# EAGLE design nakresy (EAGLE 7.2.0)
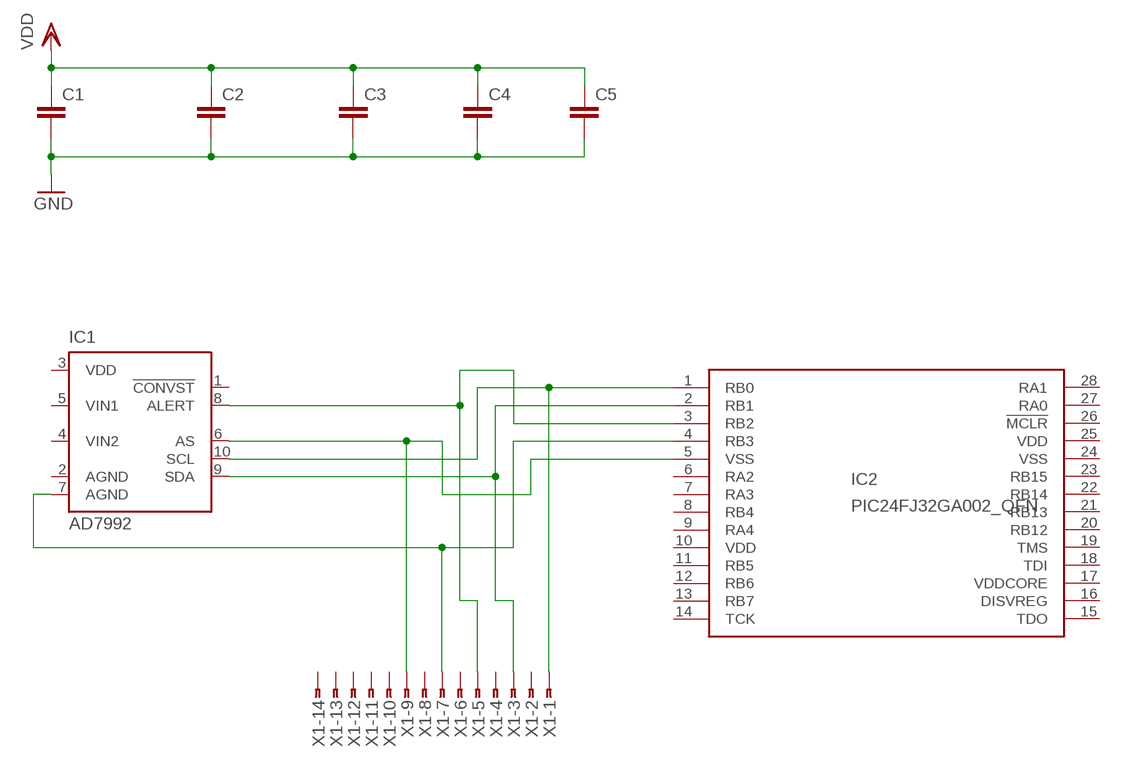
[diagram p0: schematic, sheet 1]

## Parts
C1  C-EUC0805K  [C0805K]
C2  C-EUC0805K  [C0805K]
C3  C-EUC0805K  [C0805K]
C4  C-EUC0805K  [C0805K]
C5  C-EUC0805K  [C0805K]
IC1  AD7992  [MSOP10]
IC2  PIC24FJ32GA002_QFN  [QFN28-ML_6X6MM]
X1  SMDTOP-14  [SMDTOP14]

## Nets
GND: C1.2 C2.2 C3.2 C4.2 C5.2
N$2: IC1.10(SCL) IC2.1(RB0) X1.1
N$3: IC1.9(SDA) IC2.2(RB1) X1.3
N$4: IC1.8(ALERT) IC2.3(RB2) X1.5
N$5: IC1.7(AGND) IC2.4(RB3) X1.7
N$6: IC1.6(AS) IC2.5(VSS) X1.9
VDD: C1.1 C2.1 C3.1 C4.1 C5.1
Unconnected: IC1.1(!CONVST) IC1.4(VIN2) IC1.5(VIN1) IC2.6(RA2) IC2.7(RA3) IC2.8(RB4) IC2.9(RA4) IC2.11(RB5) IC2.12(RB6) IC2.13(RB7) IC2.14(TCK) IC2.15(TDO) IC2.16(DISVREG) IC2.18(TDI) IC2.19(TMS) IC2.20(RB12) IC2.21(RB13) IC2.22(RB14) IC2.23(RB15) IC2.26(!MCLR) IC2.27(RA0) IC2.28(RA1) X1.2 X1.4 X1.6 X1.8 X1.10 X1.11 X1.12 X1.13 X1.14

## Power pins joined to a net without a drawn wire
AGND: IC1.2(AGND)
VDD: IC1.3(VDD) IC2.10(VDD) IC2.25(VDD)
VDDCORE: IC2.17(VDDCORE)
VSS: IC2.24(VSS)

## Library data of the parts
C1-C5 = rcl:C-EU: CAPACITOR, European symbol
IC1 = analog-devices:AD7992: 2-Channel, 12-Bit ADC with I2C-Compatible Interface 10-Lead MSOP Source: http://www.analog.com/UploadedFiles/Data_Sheets/224965274AD7992_0.pdf; MPN: AD7992BRMZ-0; OC_FARNELL: 1078311; OC_NEWARK: 31M4422
IC2 = microchip:PIC24FJ32GA002_QFN: PIC24FJ32GA002_QFN edit this description Auto generated by make-symbol-device-package-bsdl.ulp Rev. 25 Source: PIC24FJ32GA002_QFN.bsd; MPN: PIC24FJ32GA002-I/ML; OC_FARNELL: unknown; OC_NEWARK: 88K6121
X1 = con-amp:SMDTOP-14: AMP connector

## Board
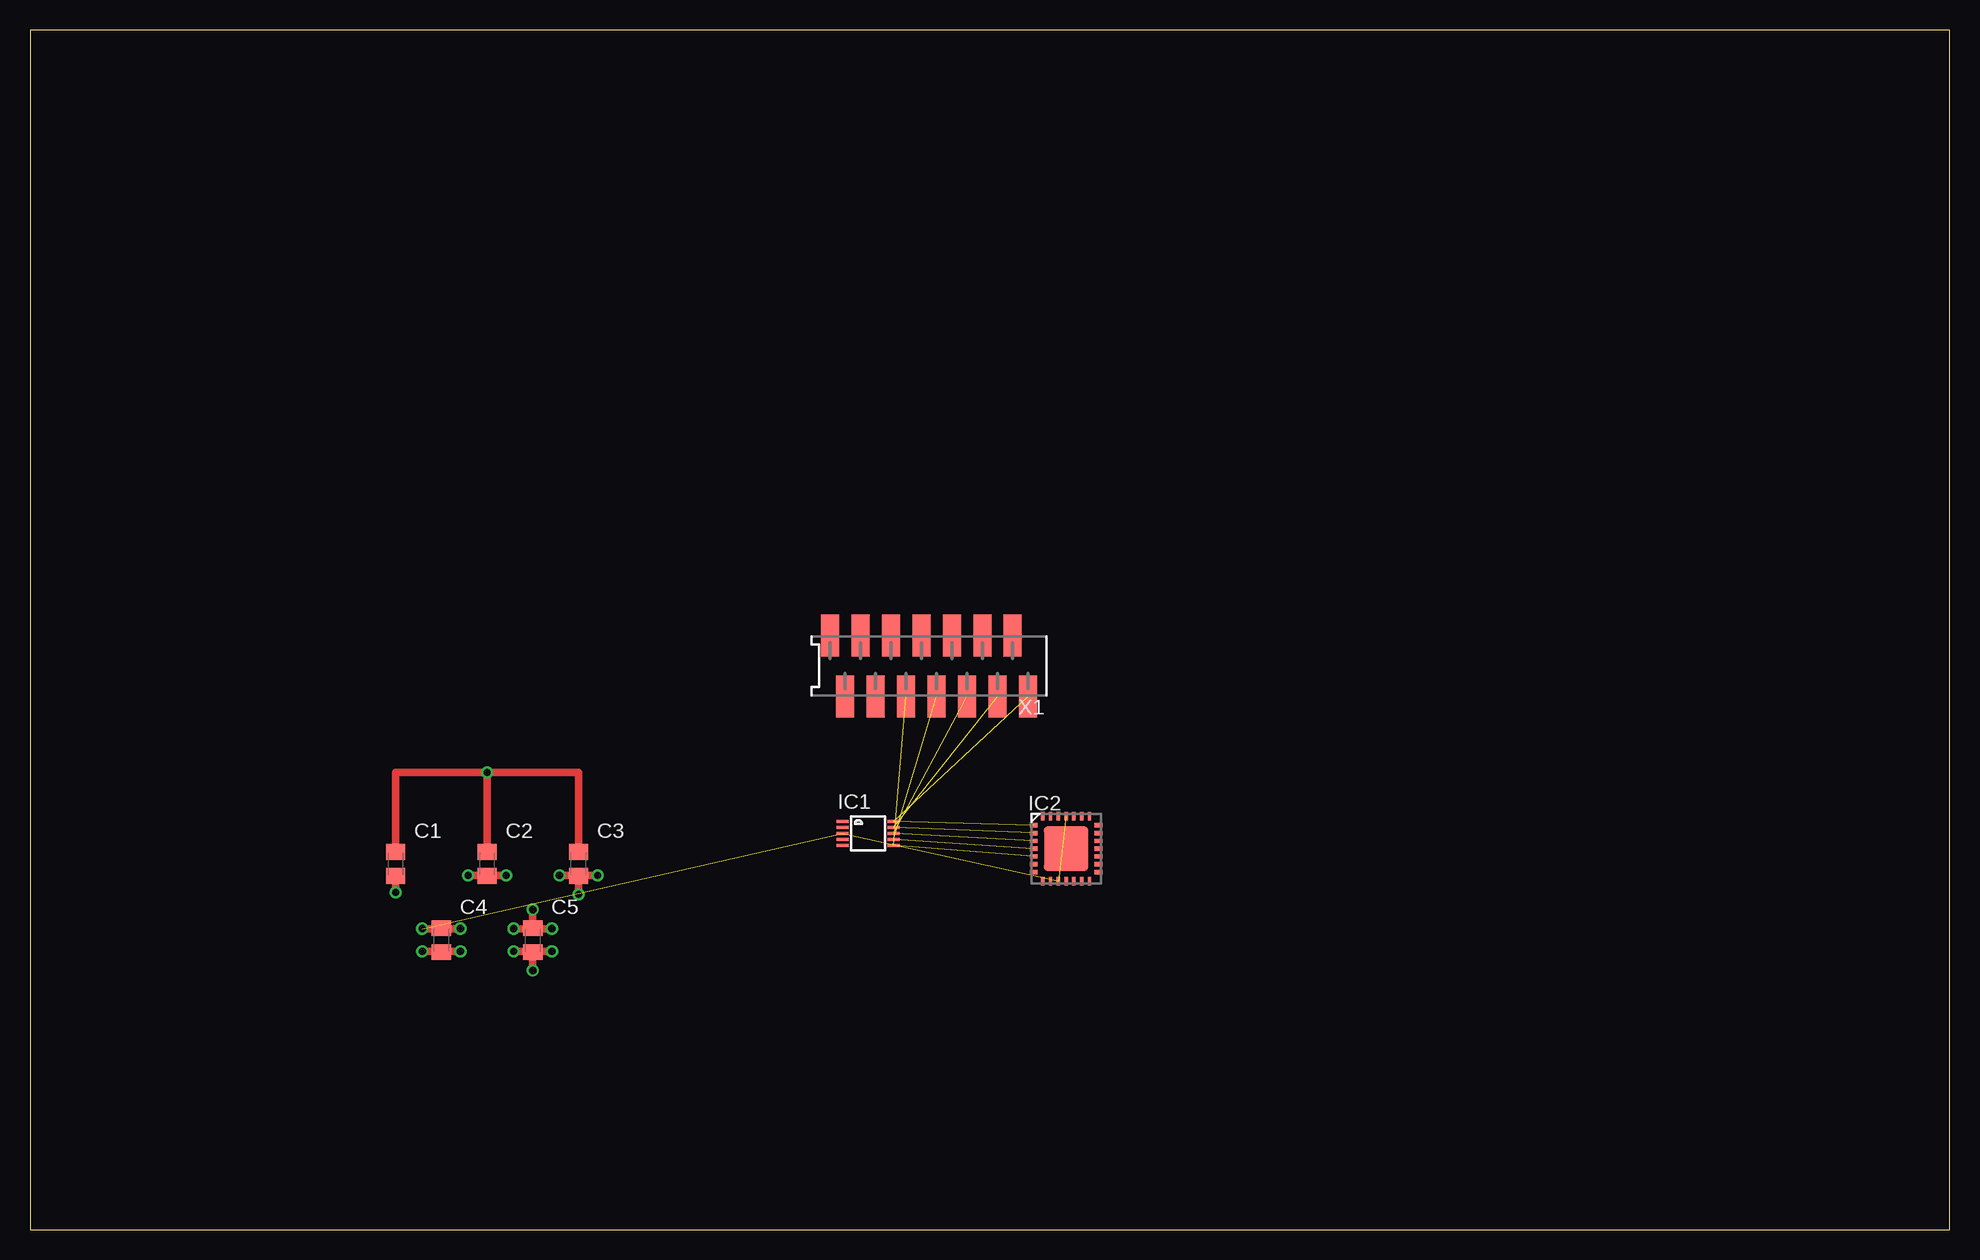
[diagram p1: board, top side]
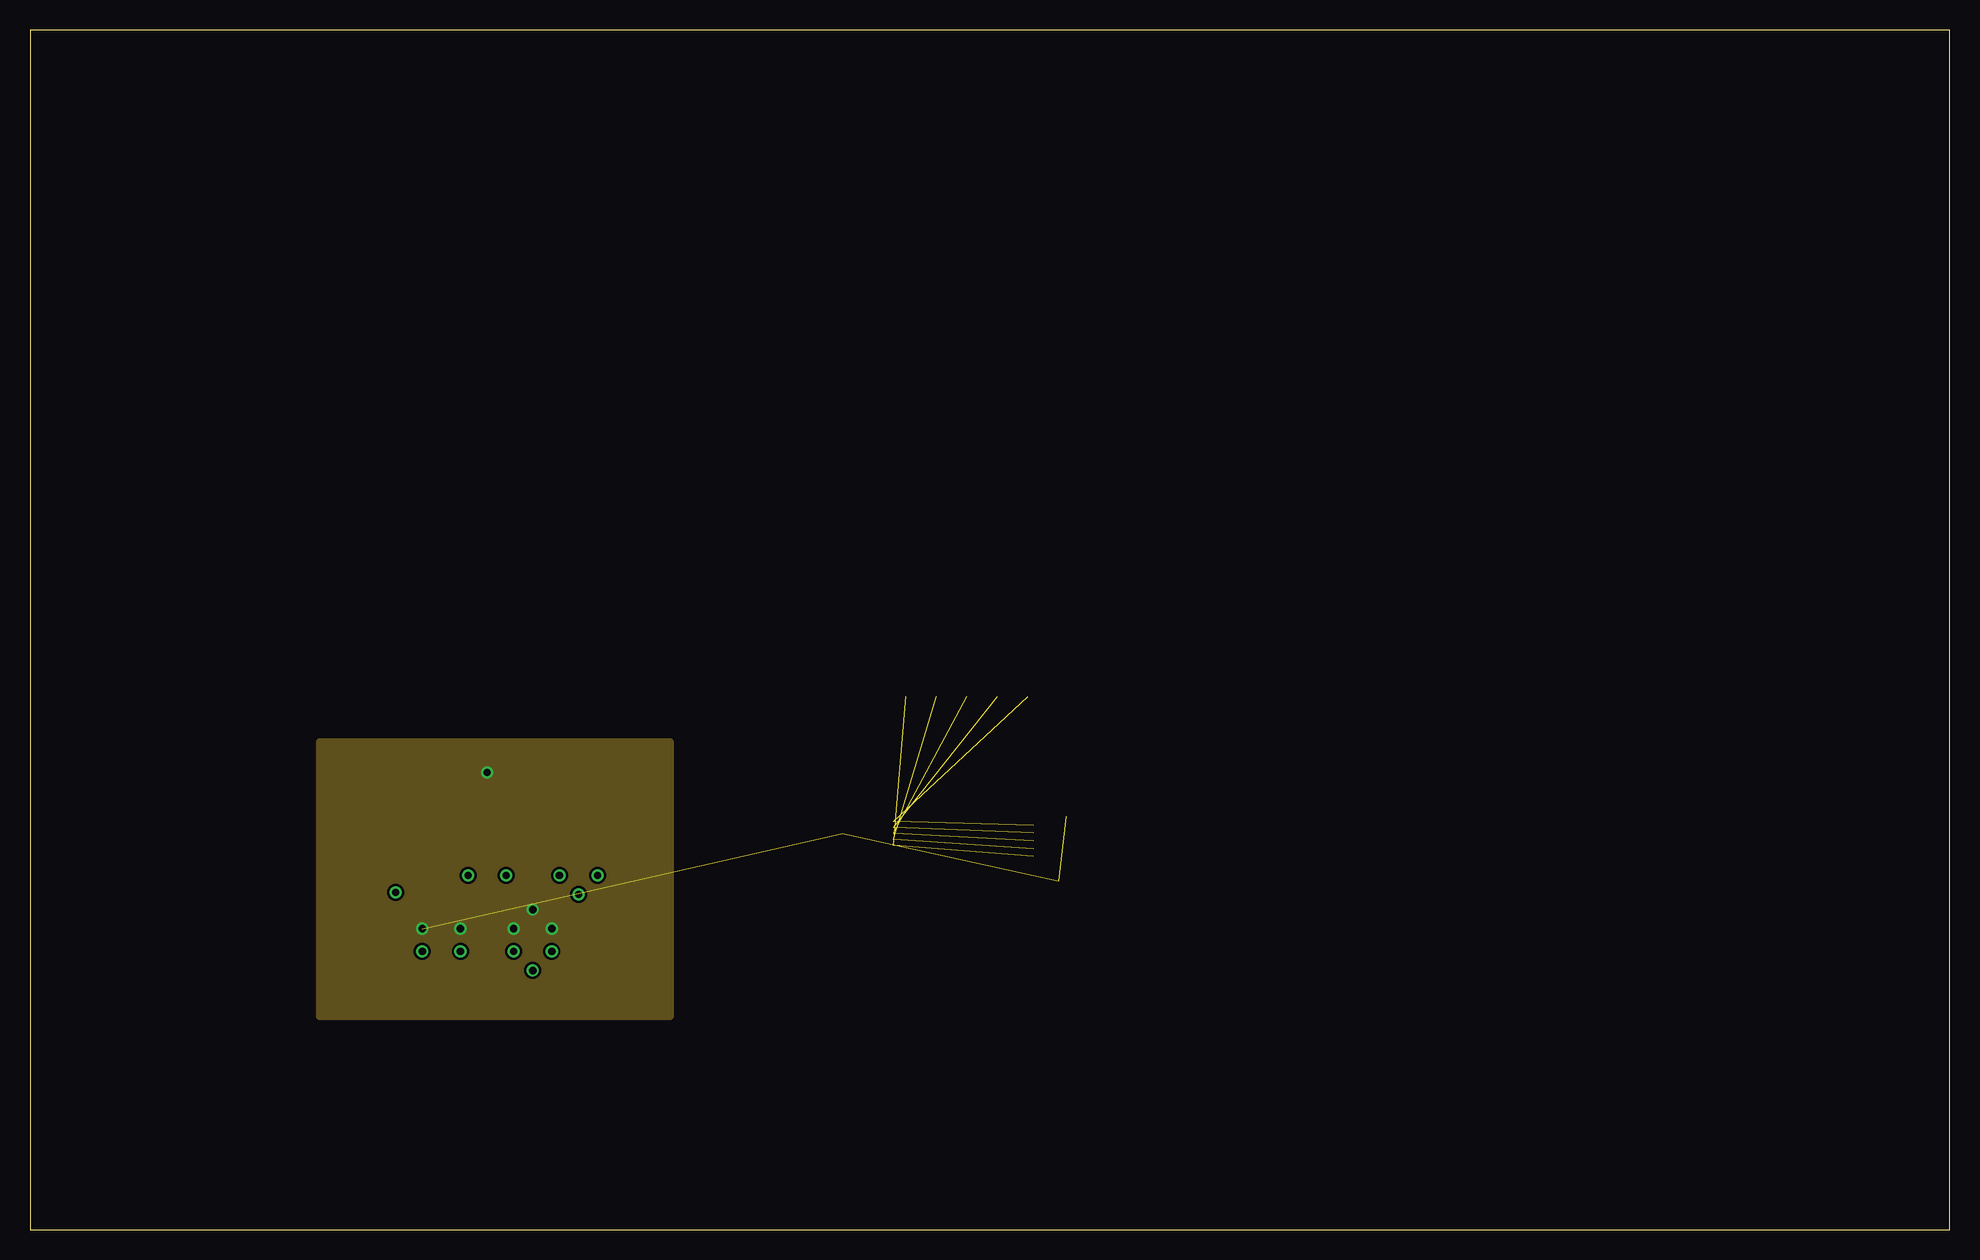
[diagram p2: board, inner layer Route3]
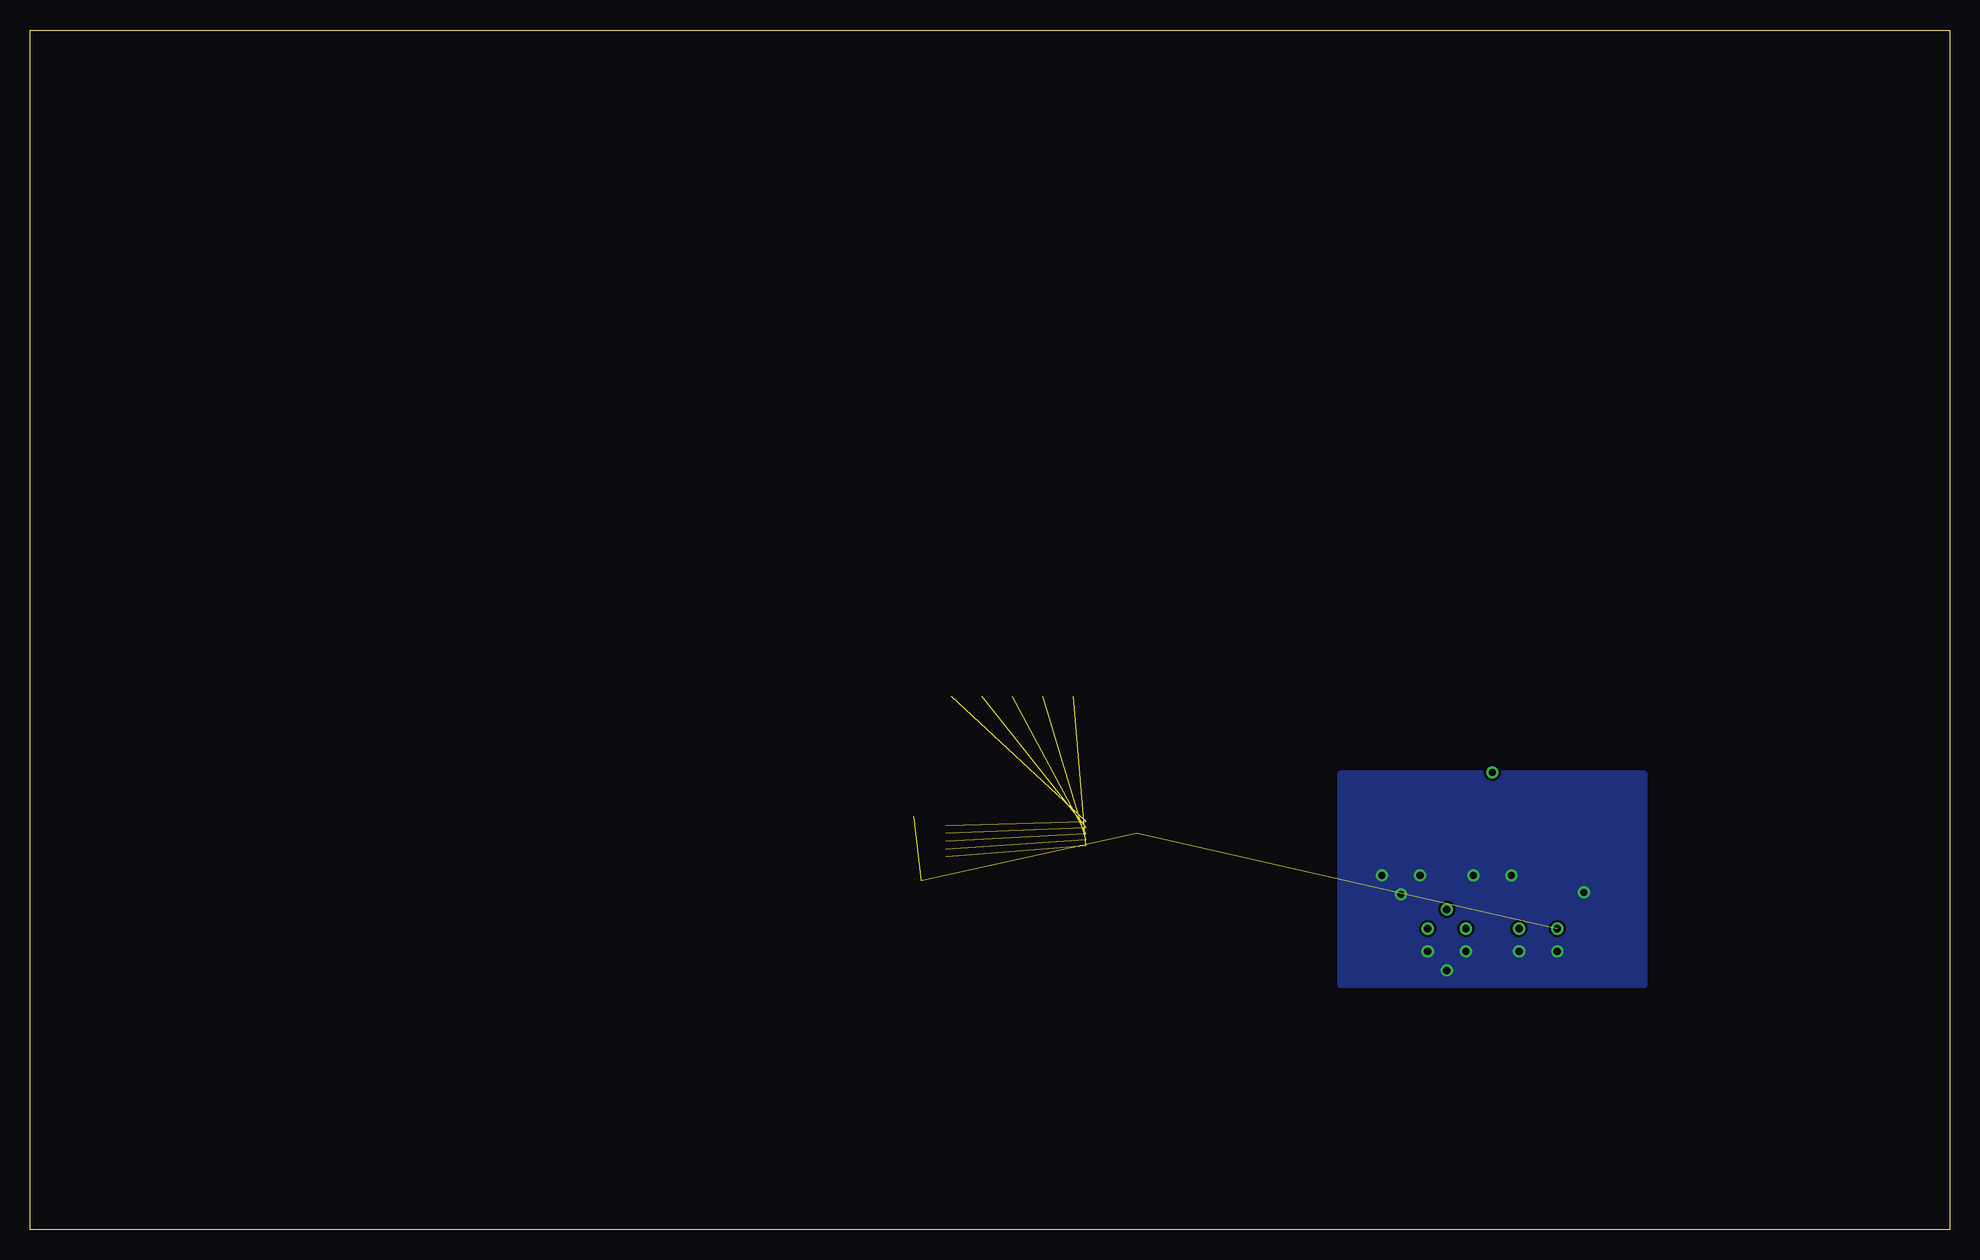
[diagram p3: board, bottom side, seen from below]

Size 160 x 100 mm. Coordinates in mm from the lower left corner, seen from the top.
Outline: 0,0 160,0 160,100 0,100 0,0
Copper layers (1*2*3*16): Top 0.035mm / dielectric 1.5mm / Route2 0.035mm / dielectric 0.15mm / Route3 0.035mm / dielectric 0.2mm / Bottom 0.035mm
Design rules "default *": minimum track width 10mil, minimum drill 24mil, track to track 8mil, track to pad 8mil, pad to pad 8mil, via to via 8mil, smd to smd 8mil, copper to edge 40mil, drill to drill 8mil, minimum pad ring 10mil, minimum via ring 8mil, stop-mask expansion 4mil, vias tented up to drill 0mil, thermal gap 10mil

### Footprints (pad centres in the part's own frame; a part is rotated, then mirrored left to right if it is on the bottom)
C0805K = smd 1.3 x 1.6: 1 -1,0; 2 1,0
MSOP10 = smd 0.25 x 1: 1 -1,-2.113; 2 -0.5,-2.113; 3 0,-2.113; 4 0.5,-2.113; 5 1,-2.113; 6 1,2.113; 7 0.5,2.113; 8 0,2.113; 9 -0.5,2.113; 10 -1,2.113
QFN28-ML_6X6MM = smd 0.7 x 0.35: 1 -2.7,1.95; 2 -2.7,1.3; 3 -2.7,0.65; 4 -2.7,0; 5 -2.7,-0.65; 6 -2.7,-1.3; 7 -2.7,-1.95; 15 2.7,-1.95; 16 2.7,-1.3; 17 2.7,-0.65; 18 2.7,0; 19 2.7,0.65; 20 2.7,1.3; 21 2.7,1.95 | smd 0.35 x 0.7: 8 -1.95,-2.7; 9 -1.3,-2.7; 10 -0.65,-2.7; 11 0,-2.7; 12 0.65,-2.7; 13 1.3,-2.7; 14 1.95,-2.7; 22 1.95,2.7; 23 1.3,2.7; 24 0.65,2.7; 25 0,2.7; 26 -0.65,2.7; 27 -1.3,2.7; 28 -1.95,2.7 | smd 3.7 x 3.7: EXP 0,0
SMDTOP14 = smd 1.5 x 3.5: 1 -8.255,2.54; 2 -6.985,-2.54; 3 -5.715,2.54; 4 -4.445,-2.54; 5 -3.175,2.54; 6 -1.905,-2.54; 7 -0.635,2.54; 8 0.635,-2.54; 9 1.905,2.54; 10 3.175,-2.54; 11 4.445,2.54; 12 5.715,-2.54; 13 6.985,2.54; 14 8.255,-2.54

### Placement (x,y rotation side)
C1  30.48,30.48 270 top
C2  38.1,30.48 270 top
C3  45.72,30.48 270 top
C4  34.29,24.13 270 top
C5  41.91,24.13 270 top
IC1  69.85,33.02 270 top
IC2  86.36,31.75 0 top
X1  74.93,46.99 180 top

### Tracks (layer width: path | path; a pad name or v marks a point on that pad's centre or on a via)
GND  (via drill 0.6)
  Top 0.61: C3.2 v45.72,27.94 | C1.2 v30.48,28.1 | v39.69,29.53 38.1,29.53 C2.2 | v36.51,29.53 37.94,29.53 | v47.31,29.53 v44.13,29.53 | v32.7,23.18 34.24,23.18 C4.2 | v35.88,23.18 34.29,23.18 | v41.91,21.59 C5.2 | v43.5,23.18 v40.32,23.18
  pour Bottom: 25.4,38.1 25.4,20.32 50.8,20.32 50.8,38.1
N$2  (2 unrouted)
N$3  (2 unrouted)
N$4  (2 unrouted)
N$5  (2 unrouted)
N$6  (2 unrouted)
VDD  (via drill 0.6)  (3 unrouted)
  Top 0.61: C1.1 30.48,38.1 v38.1,38.1 | v32.7,25.08 34.24,25.08 C4.1 34.34,25.08 v35.88,25.08 | v43.5,25.08 41.96,25.08 C5.1 | v40.32,25.08 41.86,25.08 C5.1 | v41.91,26.67 C5.1 | C2.1 v38.1,38.1 | C3.1 45.72,38.1 v38.1,38.1
  pour Route3: 24.13,40.64 24.13,17.78 53.34,17.78 53.34,40.64